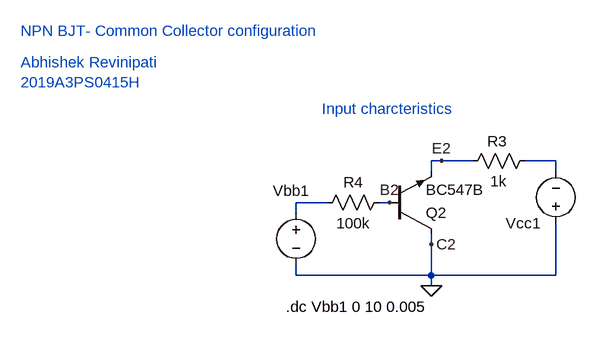
[diagram p0: schematic 2019A3PS0415_CC1.asc]
2019A3PS0415_CC1.asc, the LTspice schematic file:
Version 4
SHEET 1 880 680
WIRE 256 -160 240 -160
WIRE 304 -160 256 -160
WIRE 432 -160 384 -160
WIRE 240 -144 240 -160
WIRE 432 -144 432 -160
WIRE 80 -96 32 -96
WIRE 176 -96 160 -96
WIRE 32 -80 32 -96
WIRE 240 -32 240 -48
WIRE 32 16 32 0
WIRE 240 16 240 -32
WIRE 240 16 32 16
WIRE 432 16 432 -64
WIRE 432 16 240 16
WIRE 240 32 240 16
FLAG 240 32 0
FLAG 256 -160 E2
FLAG 176 -96 B2
FLAG 240 -32 C2
SYMBOL npn 176 -48 M180
SYMATTR InstName Q2
SYMATTR Value BC547B
SYMBOL voltage 432 -48 R180
WINDOW 123 0 0 Left 2
WINDOW 39 0 0 Left 2
SYMATTR InstName Vcc1
SYMATTR Value ""
SYMBOL voltage 32 -96 R0
WINDOW 123 0 0 Left 2
WINDOW 39 0 0 Left 2
WINDOW 0 -36 -18 Left 2
SYMATTR InstName Vbb1
SYMATTR Value ""
SYMBOL res 400 -176 R90
WINDOW 0 1 58 VBottom 2
WINDOW 3 32 56 VTop 2
SYMATTR InstName R3
SYMATTR Value 1k
SYMBOL res 64 -80 R270
WINDOW 0 32 56 VTop 2
WINDOW 3 0 56 VBottom 2
SYMATTR InstName R4
SYMATTR Value 100k
TEXT -392 -360 Left 2 ;NPN BJT- Common Collector configuration
TEXT 16 64 Left 2 !.dc Vbb1 0 10 0.005
TEXT 72 -240 Left 2 ;Input charcteristics
TEXT -392 -312 Left 2 ;Abhishek Revinipati\n2019A3PS0415H

The netlist it stands for:
* 2019A3PS0415_CC1.asc
Q2 0 B2 E2 0 BC547B
Vcc1 0 N001
Vbb1 N002 0
R3 N001 E2 1k
R4 N002 B2 100k
.model NPN NPN
.model PNP PNP
.lib standard.bjt
* NPN BJT- Common Collector configuration
.dc Vbb1 0 10 0.005
* Input charcteristics
* Abhishek Revinipati
* 2019A3PS0415H
.backanno
.end